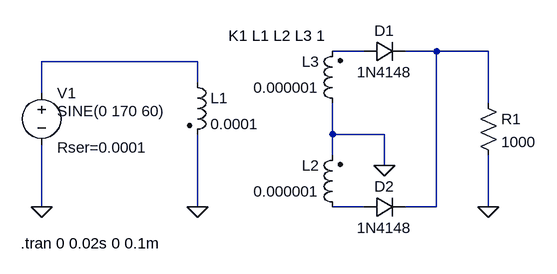
[diagram p0: schematic single-phase diode rectifier circuit.asc]
single-phase diode rectifier circuit.asc, the LTspice schematic file:
Version 4
SHEET 1 880 680
WIRE 464 48 416 48
WIRE 576 48 528 48
WIRE 656 48 576 48
WIRE 208 64 -32 64
WIRE 208 96 208 64
WIRE -32 112 -32 64
WIRE 656 128 656 48
WIRE 416 176 416 128
WIRE 496 176 416 176
WIRE 416 208 416 176
WIRE 496 224 496 176
WIRE -32 288 -32 192
WIRE 208 288 208 176
WIRE 464 288 416 288
WIRE 576 288 576 48
WIRE 576 288 528 288
WIRE 656 288 656 208
FLAG 656 288 0
FLAG -32 288 0
FLAG 208 288 0
FLAG 496 224 0
SYMBOL voltage -32 96 R0
WINDOW 3 24 44 Left 2
WINDOW 123 24 72 Left 2
WINDOW 39 24 100 Left 2
SYMATTR InstName V1
SYMATTR Value SINE(0 170 60)
SYMATTR SpiceLine Rser=0.0001
SYMBOL res 640 112 R0
SYMATTR InstName R1
SYMATTR Value 1000
SYMBOL diode 464 64 R270
WINDOW 0 32 32 VTop 2
WINDOW 3 0 32 VBottom 2
SYMATTR InstName D1
SYMATTR Value 1N4148
SYMBOL diode 464 304 R270
WINDOW 0 32 32 VTop 2
WINDOW 3 0 32 VBottom 2
SYMATTR InstName D2
SYMATTR Value 1N4148
SYMBOL ind2 192 80 R0
SYMATTR InstName L1
SYMATTR Value 0.0001
SYMATTR Type ind
SYMBOL ind2 432 304 R180
WINDOW 0 36 80 Left 2
WINDOW 3 36 40 Left 2
SYMATTR InstName L2
SYMATTR Value 0.000001
SYMATTR Type ind
SYMBOL ind2 432 144 R180
WINDOW 0 36 80 Left 2
WINDOW 3 36 40 Left 2
SYMATTR InstName L3
SYMATTR Value 0.000001
SYMATTR Type ind
TEXT -64 344 Left 2 !.tran 0 0.02s 0 0.1m
TEXT 256 24 Left 2 !K1 L1 L2 L3 1

The netlist it stands for:
* single-phase diode rectifier circuit.asc
V1 N003 0 SINE(0 170 60) Rser=0.0001
R1 N002 0 1000
D1 N001 N002 1N4148
D2 N004 N002 1N4148
L1 N003 0 0.0001
L2 N004 0 0.000001
L3 0 N001 0.000001
.model D D
.lib standard.dio
.tran 0 0.02s 0 0.1m
K1 L1 L2 L3 1
.backanno
.end